# Altium project SIMA2025.PrjPcb
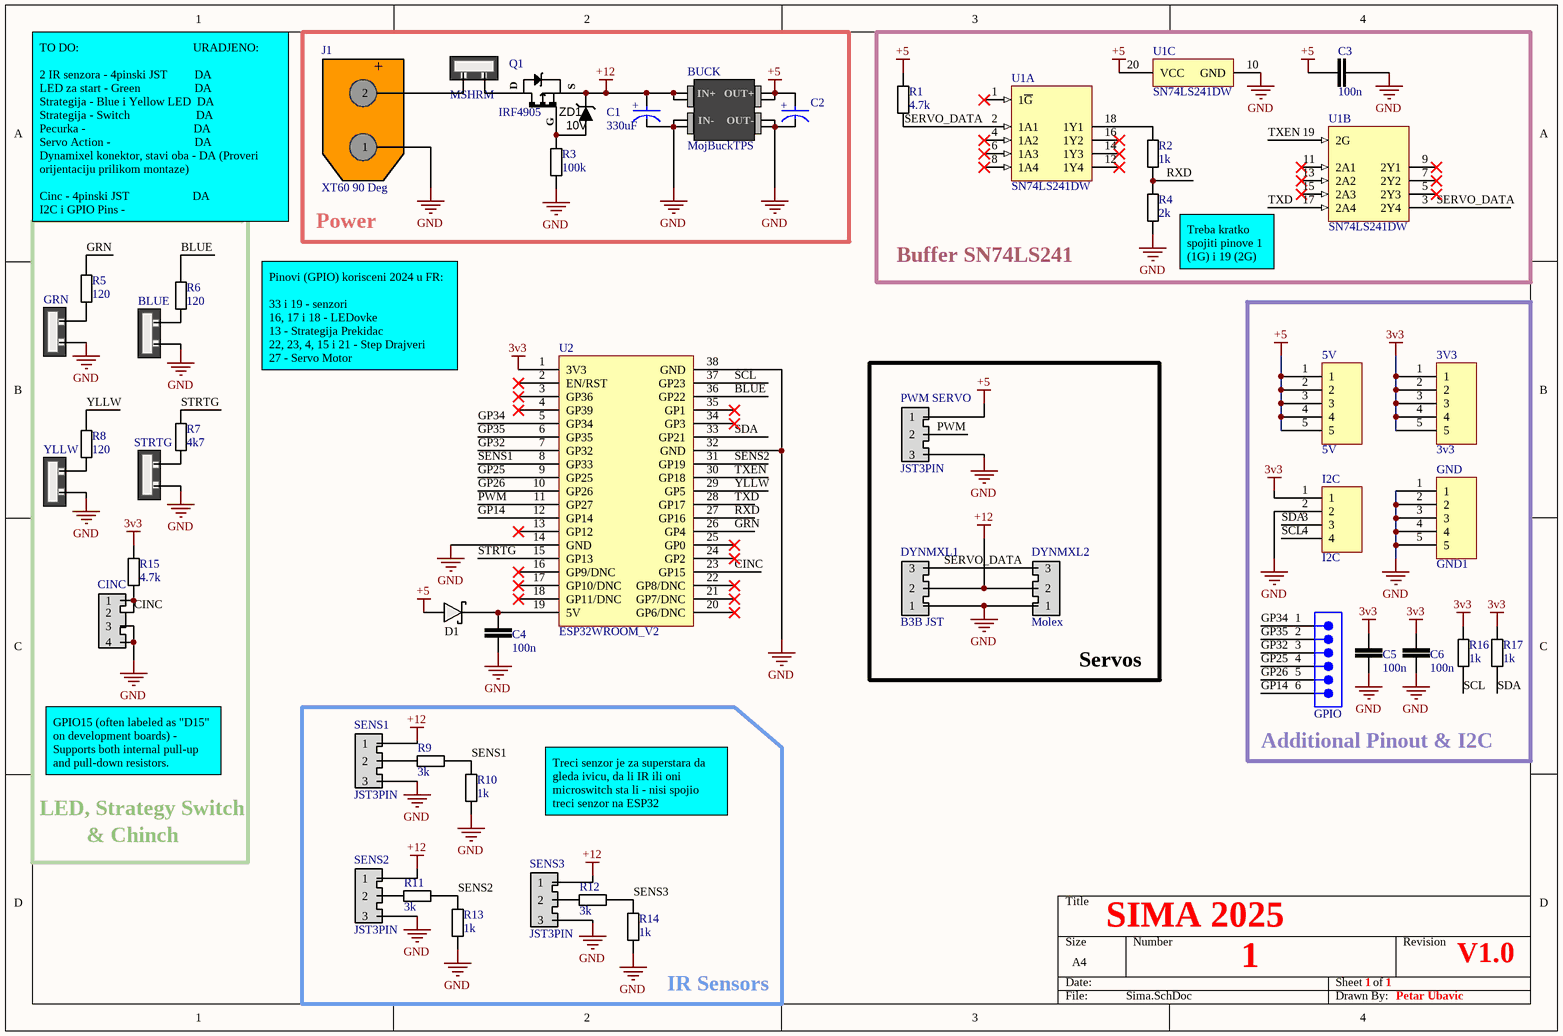
[diagram p0: Sima.SchDoc]
1 sheet, 47 parts. Net scope: global (net labels, ports and power ports of the same name join across sheets).
Board file: SIMA_PCB_2025.PcbDoc

## Sheet Sima.SchDoc
size A4; SheetNumber: 1; SheetTotal: 1

### Parts
3V3  3v3  [PIN_HEADER5]
5V  5V  [PIN_HEADER5]
BLUE  BLUE  [JST2PIN]  (value not drawn)
BUCK  MojBuckTPS  [MOJBUCKTPS_HEADER]
C1  330uF  [FP-OS-CON-TH-F13-d_0_6-MFG]
C2  25SEPF330M+T  [FP-OS-CON-TH-F13-d_0_6-MFG]  (value not drawn)
C3  100n  [CAP_0805]
C4  100n  [CAP_0805]
C5  100n  [CAP_0805]
C6  100n  [CAP_0805]
CINC  4 PIN JST XH 2.5mm pitch  [JST4PIN]  (value not drawn)
D1  SCH_DIODE  [SMA]  (value not drawn)
DYNMXL1  B3B JST  [JST3PIN]
DYNMXL2  Molex  [JST3PIN]
GND  GND1  [PIN_HEADER5]
GPIO  61300611121  [61300611121]  (value not drawn)
GRN  GRN  [JST2PIN]  (value not drawn)
I2C  I2C  [UltraSonic_Sensor]
J1  XT60 90 Deg  [XT60PW-M]
MSHRM  MSHRM  [JST2PIN]  (value not drawn)
PWM_SERVO  JST3PIN  [JST3PIN]
Q1  IRF4905  [DPAK254P1524X483-3N]
R1  4.7k  [RESISTOR_0805_SMALLSILK]
R2  1k  [RESISTOR_0805_SMALLSILK]
R3  100k  [RESISTOR_0805_SMALLSILK]
R4  2k  [RESISTOR_0805_SMALLSILK]
R5  120  [RESISTOR_0805_SMALLSILK]
R6  120  [RESISTOR_0805_SMALLSILK]
R7  4k7  [RESISTOR_0805_SMALLSILK]
R8  120  [RESISTOR_0805_SMALLSILK]
R9  3k  [RESISTOR_0805_SMALLSILK]
R10  1k  [RESISTOR_0805_SMALLSILK]
R11  3k  [RESISTOR_0805_SMALLSILK]
R12  3k  [RESISTOR_0805_SMALLSILK]
R13  1k  [RESISTOR_0805_SMALLSILK]
R14  1k  [RESISTOR_0805_SMALLSILK]
R15  4.7k  [RESISTOR_0805_SMALLSILK]
R16  1k  [RESISTOR_0805_SMALLSILK]
R17  1k  [RESISTOR_0805_SMALLSILK]
SENS1  JST3PIN  [JST3PIN]
SENS2  JST3PIN  [JST3PIN]
SENS3  JST3PIN  [JST3PIN]
STRTG  STRTG  [JST2PIN]  (value not drawn)
U1  SN74LS241DW  [DW0020A_N]  (parts A,B,C of 3)
U2  ESP32WROOM_V2  [ESP32WROOM]
YLLW  YLLW  [JST2PIN]  (value not drawn)
ZD1  10V  [DIO_SMA]

### Blocks framed on the sheet
Power: BUCK C1 C2 J1 MSHRM Q1 R3 ZD1
Buffer SN74LS241: C3 R1 R2 R4 U1
Additional Pinout & I2C: 3V3 5V C5 C6 GND GPIO I2C R16 R17
Servos: DYNMXL1 DYNMXL2 PWM_SERVO
IR Sensors: R9-R14 SENS1-SENS3

### Nets
3v3: 3V3.1 3V3.2 3V3.3 3V3.4 3V3.5 C5.1 C6.1 I2C.1 R15.2 R16.2 R17.2 U2.1(3V3)
+5: 5V.1 5V.2 5V.3 5V.4 5V.5 BUCK.7 BUCK.8 C2.2(A) C3.2 D1.1 PWM_SERVO.1 R1.2 U1.20(VCC)
+12: BUCK.1 BUCK.2 C1.2(A) DYNMXL1.2 DYNMXL2.2 Q1.3 SENS1.1 SENS2.1 SENS3.1 ZD1.1(Cathode)
GND: BLUE.1 BUCK.3 BUCK.4 BUCK.5 BUCK.6 C1.1(C) C2.1(C) C3.1 C4.2 C5.2 C6.2 CINC.3 CINC.4 DYNMXL1.1 DYNMXL2.1 GND.1 GND.2 GND.3 GND.4 GND.5 GRN.1 I2C.2 J1.1 PWM_SERVO.3 R3.1 R4.1 R10.1 R13.1 R14.1 SENS1.3 SENS2.3 SENS3.3 STRTG.1 U1.10(GND) U2.14(GND) U2.32(GND) U2.38(GND) YLLW.1
BLUE: R6.2 U2.36(GP22)
CINC: CINC.1 CINC.2 R15.1 U2.23(GP15)
GP14: GPIO.6 U2.12(GP14)
GP25: GPIO.4 U2.9(GP25)
GP26: GPIO.5 U2.10(GP26)
GP32: GPIO.3 U2.7(GP32)
GP34: GPIO.1 U2.5(GP34)
GP35: GPIO.2 U2.6(GP35)
GRN: R5.2 U2.26(GP4)
PWM: PWM_SERVO.2 U2.11(GP27)
RXD: R2.1 R4.2 U2.27(GP16)
SCL: I2C.4 R16.1 U2.37(GP23)
SDA: I2C.3 R17.1 U2.33(GP21)
SENS1: R9.1 R10.2 U2.8(GP33)
SENS2: R11.1 R13.2 U2.31(GP19)
SENS3: R12.1 R14.2
SERVO_DATA: DYNMXL1.3 DYNMXL2.3 R1.1 U1.2(1A1) U1.3(2Y4)
STRTG: R7.2 U2.15(GP13)
TXD: U1.17(2A4) U2.28(GP17)
TXEN: U1.19(2G) U2.30(GP18)
YLLW: R8.2 U2.29(GP5)
NetBLUE_2: BLUE.2 R6.1
NetC4_1: C4.1 D1.2 U2.19(5V)
NetGRN_2: GRN.2 R5.1
NetJ1_2: J1.2 MSHRM.1
NetMSHRM_2: MSHRM.2 Q1.4
NetQ1_1: Q1.1(G) R3.2 ZD1.2(Anode)
NetR2_2: R2.2 U1.18(1Y1)
NetR7_1: R7.1 STRTG.2
NetR8_1: R8.1 YLLW.2
NetR9_2: R9.2 SENS1.2
NetR11_2: R11.2 SENS2.2
NetR12_2: R12.2 SENS3.2

Not connected (* = marked no-connect by the designer): U1 1(1~{G})* 4(1A2)* 5(2Y3)* 6(1A3)* 7(2Y2)* 8(1A4)* 9(2Y1)* 11(2A1)* 12(1Y4)* 13(2A2)* 14(1Y3)* 15(2A3)* 16(1Y2)*; U2 2(EN/RST)* 3(GP36)* 4(GP39)* 13(GP12)* 16(GP9/DNC)* 17(GP10/DNC)* 18(GP11/DNC)* 20(GP6/DNC)* 21(GP7/DNC)* 22(GP8/DNC)* 24(GP2)* 25(GP0)* 34(GP3)* 35(GP1)*

### Notes on the sheet
- TO DO:                                      URADJENO:
  2 IR senzora - 4pinski JST         DA
  LED za start - Green                  DA
  Strategija - Blue i Yellow LED  DA
  Strategija - Switch                      DA
  Pecurka -                                    DA
  Servo Action -                            DA
  Dynamixel konektor, stavi oba - DA (Proveri orijentaciju prilikom montaze)
  Cinc - 4pinski JST                     DA
  I2C i GPIO Pins -
- (near R4) Treba kratko spojiti pinove 1 (1G) i 19 (2G)
- Pinovi (GPIO) korisceni 2024 u FR:
  33 i 19 - senzori
  16, 17 i 18 - LEDovke
  13 - Strategija Prekidac
  22, 23, 4, 15 i 21 - Step Drajveri
  27 - Servo Motor
- GPIO15 (often labeled as "D15" on development boards) - Supports both internal pull-up and pull-down resistors.
- LED, Strategy Switch
- & Chinch
- Treci senzor je za superstara da gleda ivicu, da li IR ili oni microswitch sta li - nisi spojio treci senzor na ESP32
- SIMA 2025
- 1
- V1.0
- Petar Ubavic
- (in symbol CMP-05428-000403-1) +
- (in symbol IRF4905) D; S
- (in symbol MojBuckTPS) IN+; OUT+; IN-; OUT-
- (in symbol XT60PW-M) +

### Library data of the parts
3V3 = PIN_HEADER5: 5 pin header 100 mil
5V GND = PIN_HEADER5: 5 pin header 100 mils
BLUE GRN MSHRM STRTG YLLW = JST2PIN: JST 2 Pin Connector
C1 C2 = CMP-05428-000403-1: Conductive Polymer Aluminum Solid Capacitors (OS-CON) 330uF ±20% 25V RADIAL TH 10x13mm; ESR (Equivalent Series Resistance): 14mR; Lead Diameter: 0.6mm; Leakage Current: 1.65mA; Life (Hours): 5000Hour; Dissipation Factor: 12%; Polarity: Polar; Ripple Current: 5A; Capacitance: 330uF; Lead Free: Lead Free; Max Operating Temperature: 105°C; Min Operating Temperature: -55°C; Package Quantity: 500; Height - Seated (Max): 0.512inch; Series: OS-CON, SEPF; Voltage: 25V; Lead Pitch: 5mm; Construction: RADIAL; Voltage Rating (DC): 25V; Case/Package: Radial; Length: 13mm; Number of Pins: 13; Voltage Rating: 25V; Diameter: 10mm; Tolerance: 20%; Mount: Through Hole; Packaging: Tape and Reel; RoHS Compliant: Yes; Termination: Radial
C3-C6 = C00079: CAP 100nF ±10% 50V 0805 X7R; capacitance: 100n
CINC = JST4PIN
DYNMXL1 = JST3PIN: ST B3B-EH-A 2.5mm pitch
DYNMXL2 = JST3PIN: Molex 0022035035 2.5mm pitch
GPIO = 61300611121: WR-PHD Pin Header, THT, Vertical, pitch 2.54mm, 1 Row, 6P; Manufacturer: Wurth Elektronik; Contact Resistance: 20mOhm; Rated Current: 3A; Working Voltage: 250V; Withstanding Voltage: 500V; Manufacturer Part Number: 61300611121; Category: Board-to-Board Connectors; Match Code: WR-PHD; ComponentLink1Description: Website Link; ComponentLink1URL: https://www.we-online.com/redexpert/article/61300611121?ad; ComponentLink2Description: Datasheet Link; ComponentLink2URL: https://www.we-online.com/redexpert/spec/61300611121?ad; Mount: Through Hole; Operating Temperature Max: 105°C; Operating Temperature Min: -40°C; Packaging: Bag; Gender: Pin Header; Number of Pins: 6; Number of Rows: 1; Orientation: Vertical; Pitch: 2.54mm
I2C = UltraSonic_Sensor: Connector onaj beli
J1 = XT60PW-M
PWM_SERVO SENS1-SENS3 = JST3PIN: 3 PIN JST XH 2.5mm pitch
Q1 = IRF4905: Manufacturer: International Rectifier; Manufacturer Part Number: IRF1404ZSPBF; Continuous Drain Current (ID): 75A; Current Rating: 49A; Drain to Source Breakdown Voltage: 40V; Drain to Source Resistance: 4mR; Drain-source On Resistance-Max: 3.7MR; Dual Supply Voltage: 55V; Element Configuration: Single; Fall Time: 58ns; Gate to Source Voltage (Vgs): 20V; Input Capacitance: 4.34nF; Max Power Dissipation: 200W; Nominal Vgs: 4V; Number of Elements: 1; Polarity: N-CHANNEL; Power Dissipation: 220W; Recovery Time: 42ns; Rise Time: 110ns; Turn-Off Delay Time: 36ns; Turn-On Delay Time: 18ns; Case/Package: D2PAK; Category: MOSFETs; Drain to Source Voltage (Vdss): 40V; Height: 4.83mm; Lead Free: Lead Free; Length: 10.67mm; Max Operating Temperature: 175°C; Min Operating Temperature: -55°C; Mount: Surface Mount; Number of Pins: 3; Package Quantity: 50; Packaging: Rail/Tube; Radiation Hardening: No; Rds On Max: 3.7mR; REACH SVHC: No SVHC; RoHS Compliant: Yes; Series: HEXFET®; Termination: SMD/SMT; Voltage Rating (DC): 55V; Width: 9.65mm; On-State Resistance: 3.7MR; Threshold Voltage: 4V
R1 R15 = R000116: RES  4k7 OHM 1% 1/8W 0805; resistance: 4.7k
R2 R10 R13 R14 R16 R17 = R000004: RES  1k OHM 1% 1/8W 0805; resistance: 1k
R3 = R000006: RES  100k OHM 1% 1/8W 0805; resistance: 100k
R4 = R000053: RES  2k OHM 1% 1/8W 0805; resistance: 2k
R5 R6 R8 = R000017: RES  120 OHM 1% 1/8W 0805; resistance: 120
R7 = R000017: RES  120 OHM 1% 1/8W 0805; resistance: 120
R9 R11 R12 = R000081: RES  3k OHM 1% 1/8W 0805; resistance: 3k
U1 = CMP-0440-00100-3: Octal Buffers And Line Drivers With 3-State Outputs, DW0020A, TUBE; Manufacturer: Texas Instruments; VCC(Min)(V): 4.75; Bits(#): 8; F @ Nom Voltage(Max)(Mhz): 35; ICC @ Nom Voltage(Max)(mA): 0.046; VCC(Max)(V): 5.25; Output Type: TTL; Voltage(Nom)(V): 5; tpd @ Nom Voltage(Max)(ns): 18; Rating: Catalog; Code_JEDEC: MS-013; Generic Part Number: SN74LS241; DatasheetVersion: SDLS144C; PackageReference: DW0020A; Operating Temperature Range(C): 0 to 70; PackageVersion: http://www.ti.com/lit/ml/mpds173a/mpds173a.pdf; Input Type: TTL
U2 = ESP32WROOM_V2: Pinout Acine ESP32 Wroom plocice, pinovi poslagani po redu
ZD1 = 1SMA5931-AU_R1: Zener Diode 10 V 5 W ±5% Surface Mount SMC (DO-214AB); Value: 10V; ComponentLink1Description: digikey; ComponentLink1URL: https://www.digikey.com/en/products/detail/panjit-international-inc/1SMC5347-AU-R1-000A1/15799564